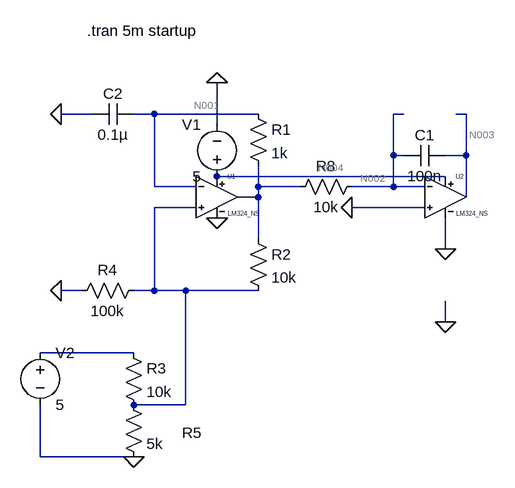
[diagram p0: schematic Draft1.asc]
Draft1.asc, the LTspice schematic file:
Version 4.1
SHEET 1 880 680
WIRE -48 0 -96 0
WIRE 48 0 16 0
WIRE 208 0 48 0
WIRE 432 0 416 0
WIRE 528 0 512 0
WIRE 144 16 144 -48
WIRE 416 64 416 0
WIRE 432 64 416 64
WIRE 528 64 528 0
WIRE 528 64 496 64
WIRE 496 96 144 96
WIRE 48 112 48 0
WIRE 112 112 48 112
WIRE 208 112 208 80
WIRE 272 112 208 112
WIRE 416 112 416 64
WIRE 416 112 352 112
WIRE 464 112 416 112
WIRE 208 128 208 112
WIRE 208 128 176 128
WIRE 528 128 528 64
WIRE 112 144 48 144
WIRE 464 144 352 144
WIRE 208 192 208 128
WIRE 496 208 496 160
WIRE -64 272 -96 272
WIRE 48 272 48 144
WIRE 48 272 16 272
WIRE 96 272 48 272
WIRE 208 272 96 272
WIRE 496 320 496 288
WIRE 16 368 -128 368
WIRE 96 448 96 272
WIRE 96 448 16 448
WIRE -128 528 -128 448
WIRE 16 528 -128 528
FLAG 144 160 0
FLAG 144 -48 0
FLAG -96 0 0
FLAG -96 272 0
FLAG 16 528 0
FLAG 496 320 0
FLAG 352 144 0
FLAG 496 208 0
SYMBOL LM324_NS 144 64 R0
SYMATTR InstName U1
SYMBOL res 192 -16 R0
SYMATTR InstName R1
SYMATTR Value 1k
SYMBOL res 192 176 R0
SYMATTR InstName R2
SYMATTR Value 10k
SYMBOL voltage 144 112 R180
WINDOW 0 24 96 Left 2
WINDOW 3 24 16 Left 2
WINDOW 123 0 0 Left 0
WINDOW 39 0 0 Left 0
SYMATTR InstName V1
SYMATTR Value 5
SYMBOL cap 16 -16 R90
WINDOW 0 0 32 VBottom 2
WINDOW 3 32 32 VTop 2
SYMATTR InstName C2
SYMATTR Value 0.1µ
SYMBOL res 32 256 R90
WINDOW 0 0 56 VBottom 2
WINDOW 3 32 56 VTop 2
SYMATTR InstName R4
SYMATTR Value 100k
SYMBOL voltage -128 352 R0
WINDOW 123 0 0 Left 0
WINDOW 39 0 0 Left 0
SYMATTR InstName V2
SYMATTR Value 5
SYMBOL res 0 352 R0
SYMATTR InstName R3
SYMATTR Value 10k
SYMBOL res 0 432 R0
WINDOW 0 90 59 Left 2
SYMATTR InstName R5
SYMATTR Value 5k
SYMBOL LM324_NS 496 64 R0
SYMATTR InstName U2
SYMBOL cap 496 48 R90
WINDOW 0 0 32 VBottom 2
WINDOW 3 32 32 VTop 2
SYMATTR InstName C1
SYMATTR Value 100n
SYMBOL res 368 96 R90
WINDOW 0 0 56 VBottom 2
WINDOW 3 32 56 VTop 2
SYMATTR InstName R8
SYMATTR Value 10k
TEXT -56 -128 Left 2 !.tran 5m startup

The netlist it stands for:
* Draft1.asc
X§U1 N006 N001 N004 0 N005 LM324/NS  ; pins In+ In- V+ V- OUT
R1 N001 N005 1k
R2 N005 N006 10k
V1 N004 0 5
C2 N001 0 0.1µ
R4 N006 0 100k
V2 N007 0 5
R3 N007 N006 10k
R5 N006 0 5k
X§U2 0 N002 N004 0 N003 LM324/NS  ; pins In+ In- V+ V- OUT
C1 N003 N002 100n
R8 N002 N005 10k
.tran 5m startup
.lib LM324.MOD
.backanno
.end

* Results of the author's LTspice run, read from the files saved beside the schematic
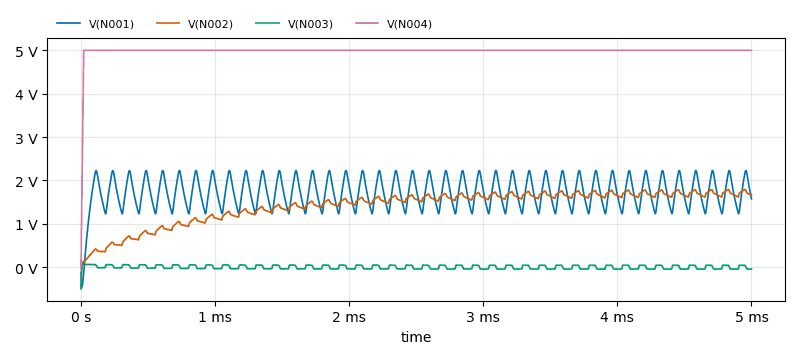
[diagram p1: Transient Analysis of Draft1.asc, plotted from the saved traces]
* Transient Analysis, 1 run:
*   V(N001): min -483.9 mV, max 2.23 V, average 1.718 V, rms 1.755 V, last 1.578 V
*   V(N002): min -478 mV, max 1.794 V, average 1.409 V, rms 1.46 V, last 1.659 V
*   V(N003): min -497.5 mV, max 90.92 mV, average 1.358 mV, rms 42.4 mV, last -43.28 mV
*   V(N004): min 0 V, max 5 V, average 4.99 V, rms 4.993 V, last 5 V